# Altium project Diode.PrjPCB
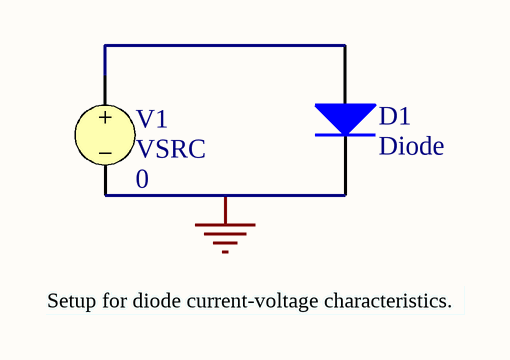
[diagram p0: Diode.SchDoc]
1 sheet, 2 parts. Net scope: global (net labels, ports and power ports of the same name join across sheets).

## Sheet Diode.SchDoc: Diode
size A; DocumentNumber: 1; SheetNumber: 1; SheetTotal: 1

### Parts
D1  Diode  [DSO-C2/X3.3]
V1  VSRC  value 0

### Nets
GND: D1.2(K) V1.2
NetD1_1: D1.1(A) V1.1

### Notes on the sheet
- Setup for diode current-voltage characteristics.
- Title
- Size:
- Date:
- A
- Number:
- Time:
- Revision:
- Sheet
- of
- File:

### Library data of the parts
D1 = Diode: Default Diode; Published: 8-Jun-2000; LatestRevisionDate: 17-Jul-2002; LatestRevisionNote: Re-released for DXP Platform.; Publisher: Altium Limited; Code_JEDEC: DO-214-AB
V1 = VSRC: Voltage Source; Manufacturer: Generic Components; Class: Simulation; Note: PCB Footprint - Not required; Published: 8/06/2000; SubClass: Voltage Source